# EAGLE design CanBusFinal (EAGLE 7.6.0)
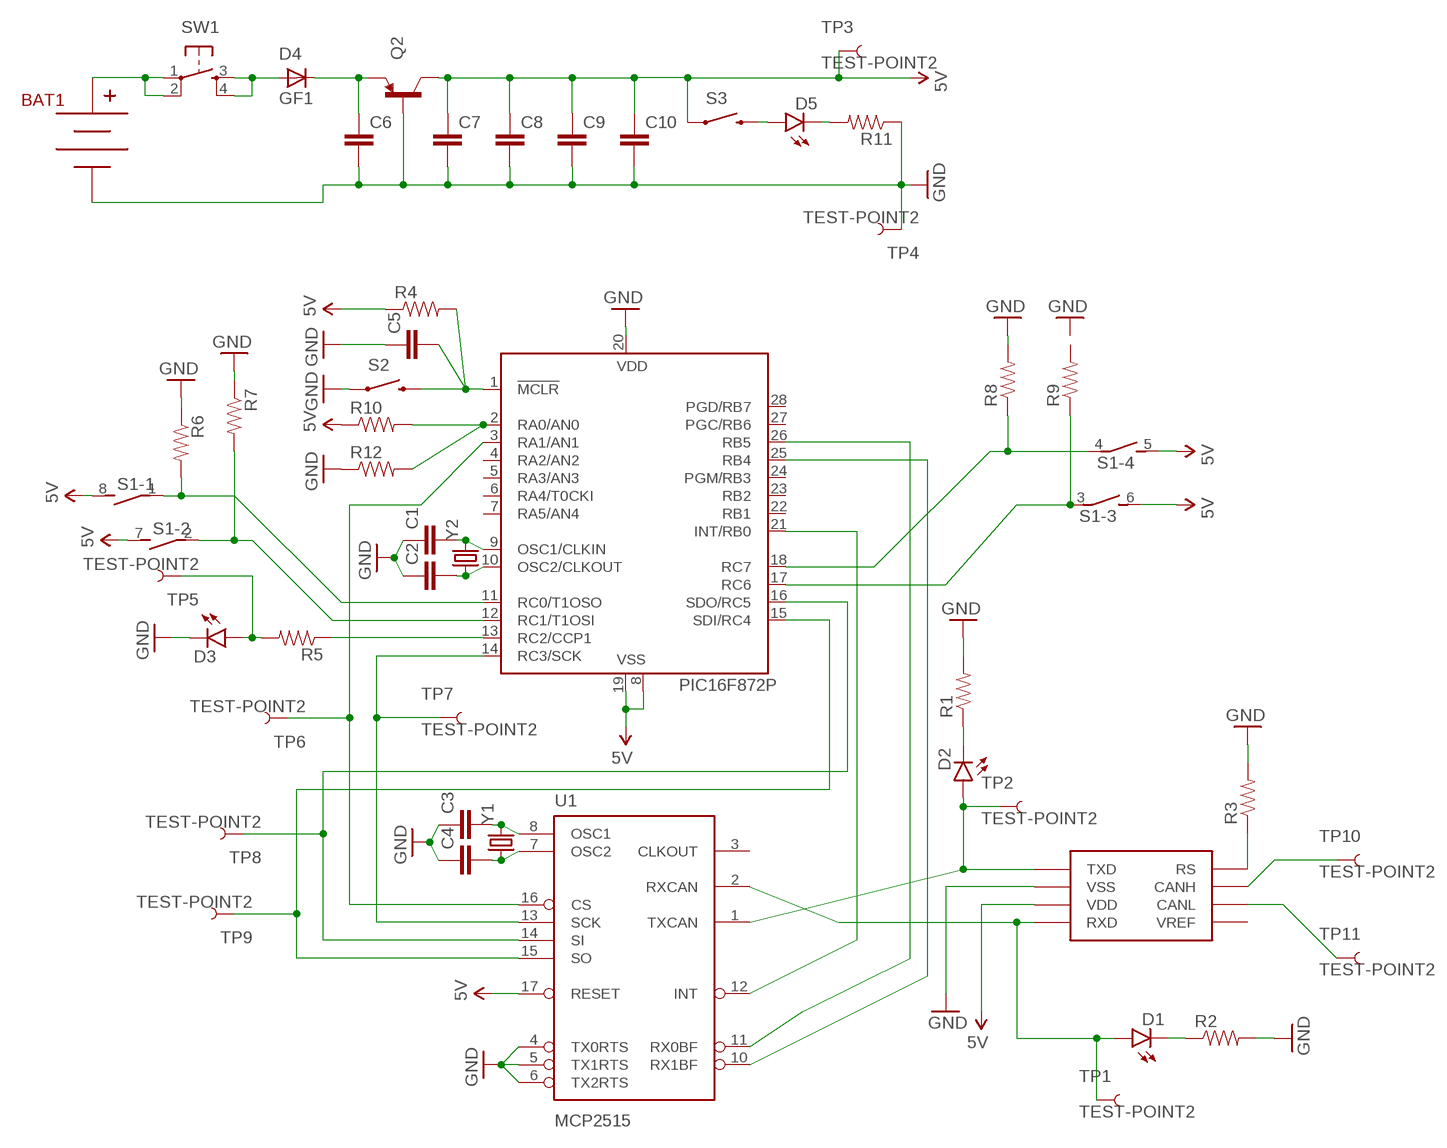
[diagram p0: schematic, sheet 1]

## Parts
BAT1  BC9VPC  [BC9VPC]
C1  CAPPTH  [CAP-PTH-SMALL]
C2  CAPPTH  [CAP-PTH-SMALL]
C3  CAPPTH  [CAP-PTH-SMALL]
C4  CAPPTH  [CAP-PTH-SMALL]
C5  CAPPTH  [CAP-PTH-SMALL]
C6  CAPPTH  [CAP-PTH-SMALL]
C7  CAPPTH  [CAP-PTH-SMALL]
C8  CAPPTH  [CAP-PTH-SMALL]
C9  CAPPTH  [CAP-PTH-SMALL]
C10  CAPPTH  [CAP-PTH-SMALL]
D1  LED5MM  [LED5MM]
D2  LED5MM  [LED5MM]
D3  LED5MM  [LED5MM]
D4  GF1  [SMA-DO214AC]
D5  LED5MM  [LED5MM]
IC1  PIC16F872P  [DIL28-3]
Q2  TRANSISTOR_PNPTO92  [TO-92]
R1  RESISTOREZ  [AXIAL-0.3EZ]
R2  RESISTOREZ  [AXIAL-0.3EZ]
R3  RESISTOREZ  [AXIAL-0.3EZ]
R4  RESISTOREZ  [AXIAL-0.3EZ]
R5  RESISTOREZ  [AXIAL-0.3EZ]
R6  RESISTOREZ  [AXIAL-0.3EZ]
R7  RESISTOREZ  [AXIAL-0.3EZ]
R8  RESISTOREZ  [AXIAL-0.3EZ]
R9  RESISTOREZ  [AXIAL-0.3EZ]
R10  RESISTOREZ  [AXIAL-0.3EZ]
R11  RESISTOREZ  [AXIAL-0.3EZ]
R12  RESISTORAXIAL-0.3  [AXIAL-0.3]
S1  DIP04S  [DIP04S]
S2  SWITCH-MOMENTARY-2PTH  [TACTILE-PTH]
S3  SWITCH-MOMENTARY-2PTH  [TACTILE-PTH]
SW1  SWITCH_SPST_4_PINSQUARE  [TACTILE-SWITCH-SMD]
TP1  TEST-POINT2  [PAD.02X.02]
TP2  TEST-POINT2  [PAD.02X.02]
TP3  TEST-POINT2  [PAD.02X.02]
TP4  TEST-POINT2  [PAD.02X.02]
TP5  TEST-POINT2  [PAD.02X.02]
TP6  TEST-POINT2  [PAD.02X.02]
TP7  TEST-POINT2  [PAD.02X.02]
TP8  TEST-POINT2  [PAD.02X.02]
TP9  TEST-POINT2  [PAD.02X.02]
TP10  TEST-POINT2  [PAD.02X.02]
TP11  TEST-POINT2  [PAD.02X.02]
U1  MCP2515  MCP2510P  [DIL18]
U$1  MCP2551  [MCP2551]
Y1  CRYSTALHC49UV  [HC49U-V]
Y2  CRYSTALHC49UV  [HC49U-V]

## Nets
5V: C7.1 C8.1 C9.1 C10.1 IC1.8(VSS) IC1.19(VSS) Q2.3(C) R4.P$1 R10.P$1 S1.5 S1.6 S1.7 S1.8 S3.1 TP3.P$1 U1.17(RESET) U$1.VDD
GND: BAT1.V- C1.1 C2.1 C3.1 C4.1 C5.1 C6.2 C7.2 C8.2 C9.2 C10.2 D3.K(C) IC1.20(VDD) Q2.2(B) R1.P$2 R2.P$2 R3.P$2 R6.P$1 R7.P$1 R8.P$2 R11.P$1 R12.P$1 S2.1 TP4.P$1 U1.4(TX0RTS) U1.5(TX1RTS) U1.6(TX2RTS) U$1.VSS
N$1: D1.A TP1.P$1 U1.2(RXCAN) U$1.RXD
N$2: D2.A TP2.P$1 U1.1(TXCAN) U$1.TXD
N$3: D2.K(C) R1.P$1
N$4: D1.K(C) R2.P$1
N$5: IC1.21(INT/RB0) U1.12(INT)
N$6: IC1.26(RB5) U1.11(RX0BF)
N$7: IC1.25(RB4) U1.10(RX1BF)
N$8: IC1.11(RC0/T1OSO) R6.P$2 S1.1
N$9: R3.P$1 U$1.RS
N$10: IC1.2(RA0/AN0) R10.P$2 R12.P$2
N$11: C3.2 U1.8(OSC1) Y1.2
N$12: C4.2 U1.7(OSC2) Y1.1
N$13: C1.2 IC1.9(OSC1/CLKIN) Y2.2
N$14: C2.2 IC1.10(OSC2/CLKOUT) Y2.1
N$15: IC1.14(RC3/SCK) TP7.P$1 U1.13(SCK)
N$16: IC1.16(SDO/RC5) TP8.P$1 U1.14(SI)
N$17: IC1.15(SDI/RC4) TP9.P$1 U1.15(SO)
N$18: IC1.3(RA1/AN1) TP6.P$1 U1.16(CS)
N$19: C5.2 IC1.1(!MCLR!) R4.P$2 S2.3
N$20: IC1.13(RC2/CCP1) R5.P$1
N$21: D3.A R5.P$2 TP5.P$1
N$23: IC1.12(RC1/T1OSI) R7.P$2 S1.2
N$24: IC1.17(RC6) R9.P$1 S1.3
N$25: IC1.18(RC7) R8.P$1 S1.4
N$26: D4.A SW1.3 SW1.4
N$27: C6.1 D4.K(C) Q2.1(E)
N$28: D5.K(C) R11.P$2
N$29: BAT1.V+ SW1.1 SW1.2
N$30: D5.A S3.3
N$31: TP11.P$1 U$1.CANL
N$32: TP10.P$1 U$1.CANH
Unconnected: IC1.4(RA2/AN2) IC1.5(RA3/AN3) IC1.6(RA4/T0CKI) IC1.7(RA5/AN4) IC1.22(RB1) IC1.23(RB2) IC1.24(PGM/RB3) IC1.27(PGC/RB6) IC1.28(PGD/RB7) R9.P$2 U1.3(CLKOUT) U$1.VREF

## Power pins joined to a net without a drawn wire
VDD: U1.18(VDD)
VSS: U1.9(VSS)

## Library data of the parts
BAT1 = SparkFun-Connectors:BC9VPC: 9V board-mount battery cradle; PROD_ID: BATT-10855
C1-C10 = SparkFun-Passives:CAP: Capacitor Standard 0603 ceramic capacitor, and 0.1" leaded capacitor.
D1-D3 D5 = SparkFun-LED:LED: LEDs Standard schematic elements and footprints for 5mm, 3mm, 1206, and 0603 sized LEDs. 5mm - Spark Fun Electronics SKU : COM-00529 (and others)
D4 = diode:GF1: DIODE
IC1 = microchip:PIC16*872: MICROCONTROLLER flash type; MF: MICROCHIP; MPN: PIC16F872-I/SP; OC_FARNELL: 9761012; OC_NEWARK: 12C1945
Q2 = SparkFun-DiscreteSemi:TRANSISTOR_PNP: Generic PNP BJT Double check pinouts against datasheets- not all devices are the same! MMBT3906 - 40V 200mA SOT-23 (TRANS-08052) MMBT4403 - 40V 600mA SOT-23 (TRANS-09245)
R1-R11 = SparkFun-Passives:RESISTOR: Resistor Basic schematic elements and footprints for 0603, 1206, and PTH resistors.
R12 = SparkFun-Resistors:RESISTOR: Resistor Basic schematic elements and footprints for 0603, 1206, and PTH resistors.
S1 = switch-dil:DIP04S: DIL/CODE SWITCH; OC_FARNELL: unknown; OC_NEWARK: unknown
S2 S3 = SparkFun-Electromechanical:SWITCH-MOMENTARY-2: Various NO switches- pushbuttons, reed, etc; PROD_ID: SWCH-08441
SW1 = SparkFun-Electromechanical:SWITCH_SPST_4_PIN; PROD_ID: SWCH-08247
TP1-TP11 = SparkFun-Passives:TEST-POINT: Bare copper test points for troubleshooting or ICT
U1 = SparkFun-DigitalIC:MCP2510: CAN controller with SPI interface to any MCU. Original design by Microchip.
U$1 = mylibrary:MCP2551
Y1 Y2 = SparkFun-FreqCtrl:CRYSTAL: Various standard crystals. Proven footprints.

## Board
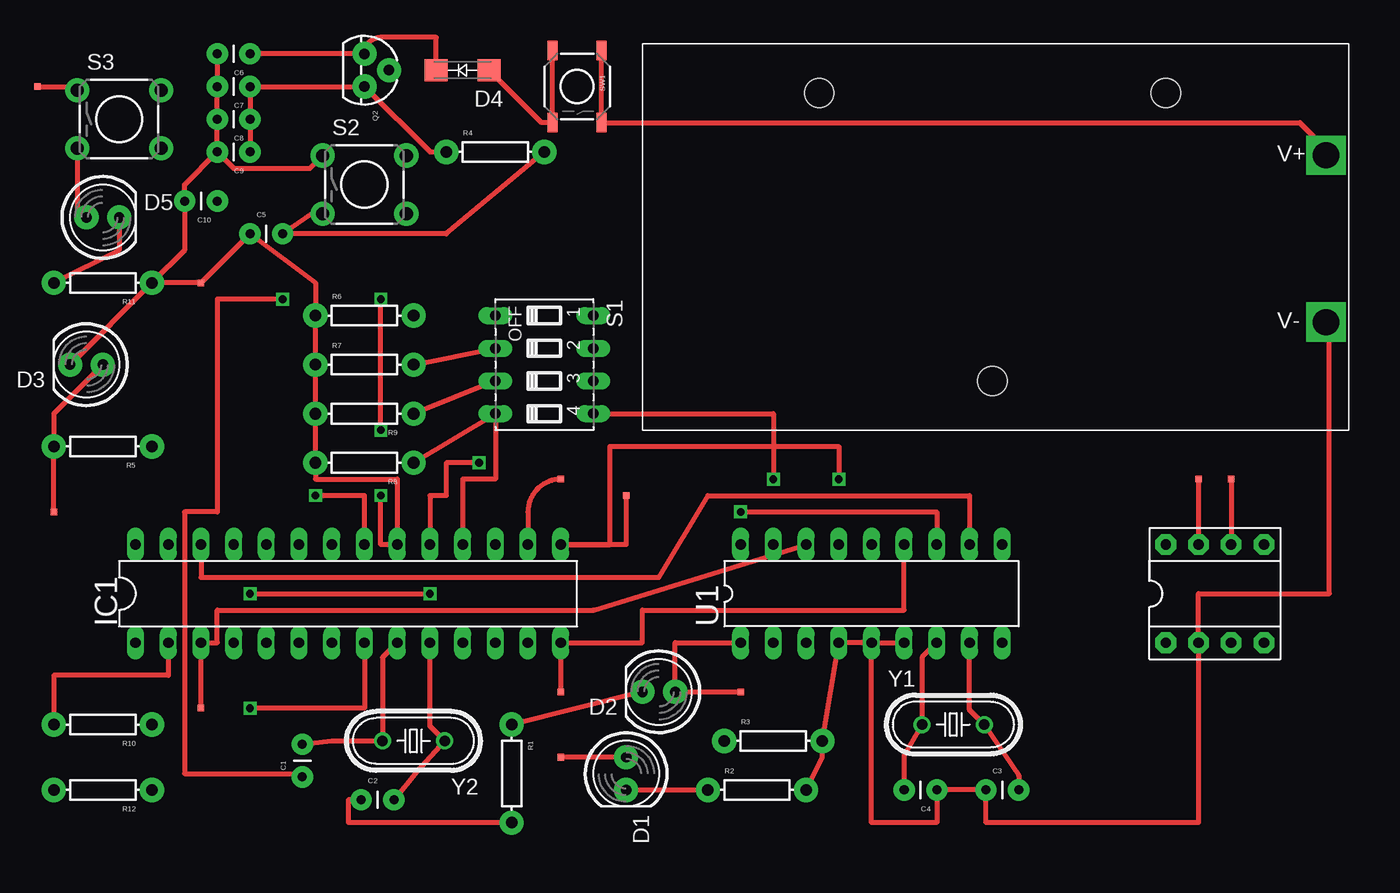
[diagram p1: board, top side]
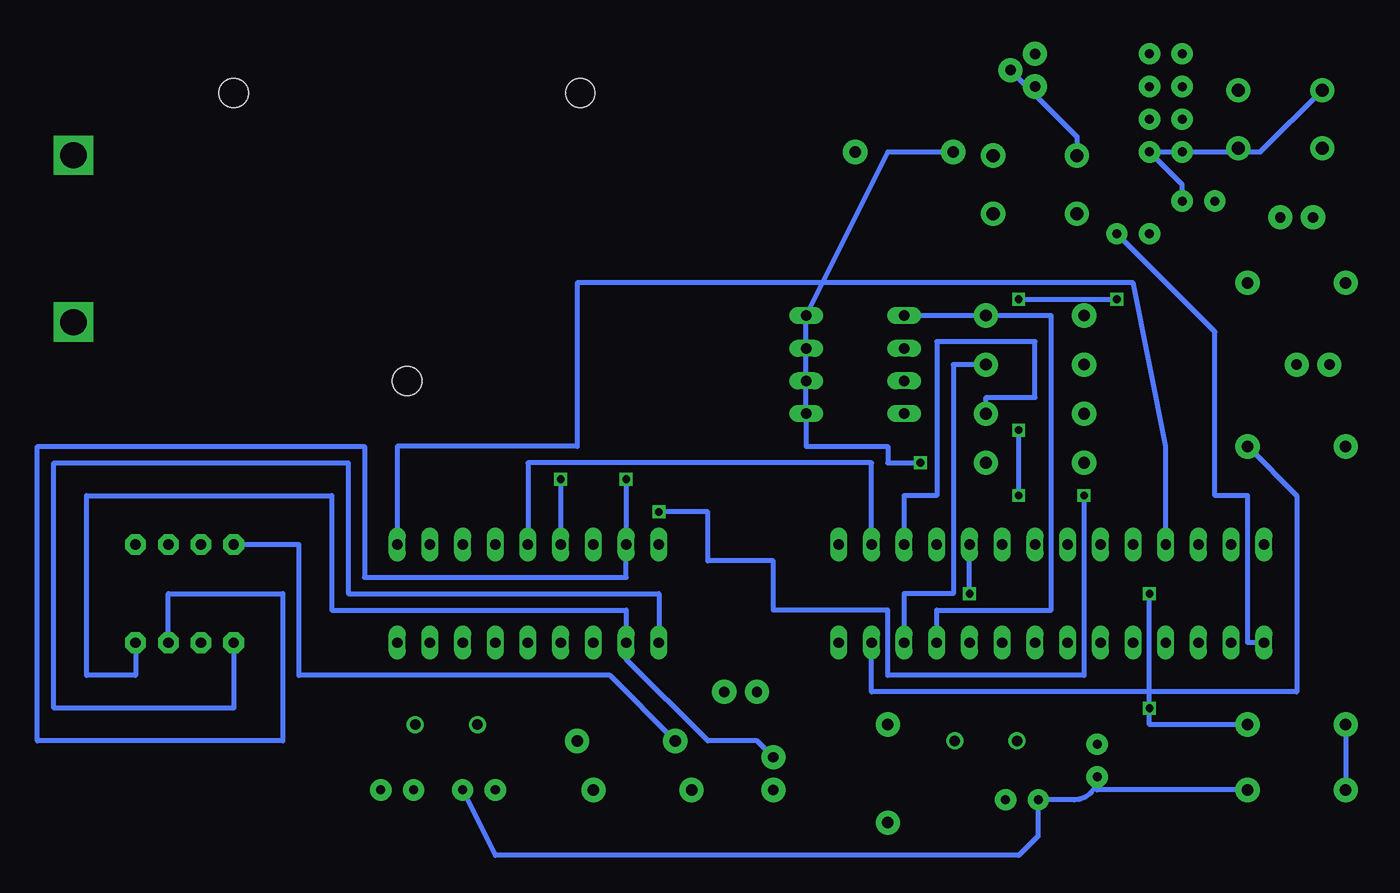
[diagram p2: board, bottom side, seen from below]

No outline drawn. Coordinates in mm, seen from the top.
Copper layers (1*16): Top 0.035mm / dielectric 1.5mm / Bottom 0.035mm
Design rules "default": minimum track width 10mil, minimum drill 24mil, track to track 8mil, track to pad 8mil, pad to pad 8mil, via to via 8mil, smd to smd 8mil, copper to edge 40mil, drill to drill 8mil, minimum pad ring 10mil, minimum via ring 8mil, stop-mask expansion 4mil, vias tented up to drill 0mil, thermal gap 10mil

### Footprints (pad centres in the part's own frame; a part is rotated, then mirrored left to right if it is on the bottom)
BC9VPC = drill 2.032 square: V+ 53.086,21.336; V- 53.086,8.382 | hole 2.286: 27.178,3.81; 13.716,26.162; 40.64,26.162
CAP-PTH-SMALL = drill 0.7 pad 1.651: 1 0,0; 2 2.54,0
LED5MM = drill 0.813 pad 1.88: A -1.27,0; K 1.27,0
SMA-DO214AC = smd 1.8 x 1.7: A -2.05,0; K 2.05,0
DIL28-3 = drill 0.813 long: 1 -16.51,-3.81; 2 -13.97,-3.81; 3 -11.43,-3.81; 4 -8.89,-3.81; 5 -6.35,-3.81; 6 -3.81,-3.81; 7 -1.27,-3.81; 8 1.27,-3.81; 9 3.81,-3.81; 10 6.35,-3.81; 11 8.89,-3.81; 12 11.43,-3.81; 13 13.97,-3.81; 14 16.51,-3.81; 15 16.51,3.81; 16 13.97,3.81; 17 11.43,3.81; 18 8.89,3.81; 19 6.35,3.81; 20 3.81,3.81; 21 1.27,3.81; 22 -1.27,3.81; 23 -3.81,3.81; 24 -6.35,3.81; 25 -8.89,3.81; 26 -11.43,3.81; 27 -13.97,3.81; 28 -16.51,3.81
TO-92 = drill 0.813 pad 1.88: 1 -1.27,0; 2 0,1.905; 3 1.27,0
AXIAL-0.3EZ = drill 0.9 pad 1.88: P$1 -3.81,0; P$2 3.81,0
AXIAL-0.3 = drill 0.9 pad 1.88: P$1 -3.81,0; P$2 3.81,0
DIP04S = drill 0.813 long: 1 -3.81,-3.81; 2 -1.27,-3.81; 3 1.27,-3.81; 4 3.81,-3.81; 5 3.81,3.81; 6 1.27,3.81; 7 -1.27,3.81; 8 -3.81,3.81
TACTILE-PTH = drill 1.016 pad 1.88: 1 -3.251,2.261; 2 3.251,2.261; 3 -3.251,-2.261; 4 3.251,-2.261
TACTILE-SWITCH-SMD = smd 1.524 x 0.762: 1 -2.794,1.905; 2 2.794,1.905; 3 -2.794,-1.905; 4 2.794,-1.905
PAD.02X.02 = smd 0.508 x 0.508: P$1 0,0
DIL18 = drill 0.813 long: 1 -10.16,-3.81; 2 -7.62,-3.81; 3 -5.08,-3.81; 4 -2.54,-3.81; 5 0,-3.81; 6 2.54,-3.81; 7 5.08,-3.81; 8 7.62,-3.81; 9 10.16,-3.81; 10 10.16,3.81; 11 7.62,3.81; 12 5.08,3.81; 13 2.54,3.81; 14 0,3.81; 15 -2.54,3.81; 16 -5.08,3.81; 17 -7.62,3.81; 18 -10.16,3.81
MCP2551 = drill 0.813 pad 1.6 octagon: CANH -1.27,3.81; CANL 1.27,3.81; RS -3.81,3.81; RXD 3.81,-3.81; TXD -3.81,-3.81; VDD 1.27,-3.81; VREF 3.81,3.81; VSS -1.27,-3.81
HC49U-V = drill 0.813: 1 -2.413,0; 2 2.413,0

### Placement (x,y rotation side)
BAT1  46.99,33.02 0 top
C1  20.57,6.1 90 top
C2  25.15,4.32 0 top
C3  73.66,5.08 0 top
C4  69.85,5.08 180 top
C5  16.51,48.26 0 top
C6  16.51,62.23 180 top
C7  16.51,59.69 180 top
C8  16.51,57.15 180 top
C9  16.51,54.61 180 top
C10  13.97,50.8 180 top
D1  45.72,6.35 270 top
D2  48.26,12.7 180 top
D3  3.81,38.1 180 top
D4  33.02,60.96 180 top
D5  5.08,49.53 0 top
IC1  24.13,20.32 0 top
Q2  25.4,60.96 270 top
R1  36.83,6.35 270 top
R2  55.88,5.08 0 top
R3  57.15,8.89 0 top
R4  35.56,54.61 0 top
R5  5.08,31.75 180 top
R6  25.4,41.91 0 top
R7  25.4,38.1 0 top
R8  25.4,30.48 180 top
R9  25.4,34.29 180 top
R10  5.08,10.16 180 top
R11  5.08,44.45 180 top
R12  5.08,5.08 180 top
S1  39.37,38.1 270 top
S2  25.4,52.07 0 top
S3  6.35,57.15 0 top
SW1  41.91,59.69 270 top
TP1  40.64,7.62 90 top
TP2  54.61,12.7 0 top
TP3  0,59.69 0 top
TP4  12.7,44.45 0 top
TP5  1.27,26.67 0 top
TP6  12.7,11.43 0 top
TP7  40.64,12.7 0 top
TP8  40.64,29.21 0 top
TP9  45.72,27.94 0 top
TP10  90.17,29.21 0 top
TP11  92.71,29.21 0 top
U1  64.77,20.32 0 top
U$1  91.44,20.32 0 top
Y1  71.12,10.16 0 top
Y2  29.21,8.89 180 top

### Tracks (layer width: path | path; a pad name or v marks a point on that pad's centre or on a via)
5V  (via drill 0.6)
  Top 0.406: C9.1 C8.1 C7.1 Q2.3 30.48,54.61 R4.P$1 | TP3.P$1 2.82,59.69 S3.1 | S1.5 57.15,34.29 v57.15,29.21 | v34.29,30.48 31.75,30.48 31.75,27.94 30.48,27.94 IC1.19 | IC1.8 25.4,11.43 v16.51,11.43 | v16.51,20.32 v30.48,20.32
  Bottom 0.406: S3.1 7.9,54.61 C9.1 13.97,52.07 C10.1 | R4.P$1 36.83,54.61 S1.8 S1.7 S1.6 S1.5 43.18,31.75 36.83,31.75 36.83,30.48 v34.29,30.48 | U$1.VDD 92.71,20.32 83.82,20.32 83.82,8.89 102.87,8.89 102.87,31.75 77.47,31.75 77.47,21.59 57.15,21.59 U1.17 v57.15,29.21 | v16.51,20.32 v16.51,11.43 16.51,10.16 R10.P$1 | v30.48,20.32 IC1.19
GND  (via drill 0.6)
  Top 0.406: C6.2 C7.2 C8.2 C9.2 | C9.2 11.43,52.07 C10.2 11.43,46.99 R11.P$1 | C9.2 15.24,53.34 21.16,53.34 S2.1 | R11.P$1 TP4.P$1 C5.1 21.59,44.45 R6.P$1 R7.P$1 R8.P$2 21.59,29.21 27.94,29.21 IC1.20 26.67,24.13 v26.67,27.94 | R11.P$1 D3.K | BAT1.V- 100.33,41.4 100.33,20.32 90.17,20.32 U$1.VSS 90.17,2.54 73.66,2.54 C3.1 C4.1 69.85,2.54 64.77,2.54 U1.5 | U1.5 U1.4 R3.P$2 60.96,7.62 R2.P$2 | U1.5 U1.6 | R1.P$2 24.13,2.54 24.13,4.32 C2.1 | v26.67,33.02 v26.67,43.18 | v19.05,43.18 13.97,43.18 13.97,26.67 11.43,26.67 11.43,6.35 20.57,6.35 C1.1
  Bottom 0.406: Q2.2 22.15,55.8 S2.1 | C4.1 67.31,0 26.67,0 25.15,1.52 C2.1 22.35,4.32 arc-90 C1.1 | v26.67,27.94 v26.67,33.02 | v26.67,43.18 v19.05,43.18 | 20.57,6.35 C1.1 | R12.P$1 20.57,5.08 C1.1
N$1
  Top 0.406: D1.A TP1.P$1
  Bottom 0.406: D1.A 46.99,8.89 50.8,8.89 57.15,15.24 U1.2 57.15,19.05 80.01,19.05 80.01,27.94 99.06,27.94 99.06,13.97 95.25,13.97 U$1.RXD
N$2
  Top 0.406: U1.1 49.53,16.51 D2.A TP2.P$1
  Bottom 0.406: U$1.TXD 87.63,11.43 101.6,11.43 101.6,30.48 78.74,30.48 78.74,20.32 54.61,20.32 U1.1
N$3
  Top 0.406: D2.K R1.P$1
N$4
  Top 0.406: D1.K R2.P$1
N$5  (via drill 0.6)
  Top 0.406: IC1.21 25.4,27.94 v21.59,27.94 | v54.61,26.67 69.85,26.67 U1.12
  Bottom 0.406: v21.59,27.94 21.59,13.97 36.83,13.97 36.83,19.05 45.72,19.05 45.72,22.86 50.8,22.86 50.8,26.67 v54.61,26.67
N$6
  Top 0.406: IC1.26 12.7,21.59 48.26,21.59 52.07,27.94 72.39,27.94 U1.11
N$7
  Bottom 0.406: IC1.25 15.24,31.75 17.78,44.45 60.96,44.45 60.96,31.75 74.93,31.75 U1.10
N$8
  Bottom 0.406: S1.1 R6.P$2 24.13,41.91 24.13,19.05 33.02,19.05 IC1.11
N$9
  Bottom 0.406: R3.P$1 58.42,13.97 82.55,13.97 82.55,24.13 U$1.RS
N$10
  Top 0.406: IC1.2 10.16,13.97 1.27,13.97 R10.P$2
  Bottom 0.406: R10.P$2 R12.P$2
N$11
  Top 0.406: U1.8 72.39,11.3 Y1.2 76.2,6.22 C3.2
N$12
  Top 0.406: U1.7 68.71,15.37 Y1.1 67.31,7.75 C4.2
N$13
  Top 0.406: C1.2 22.86,8.89 Y2.2 26.8,15.37 IC1.9
N$14
  Top 0.406: IC1.10 30.48,10.03 Y2.1 29.46,6.48 C2.2
N$15
  Top 0.406: TP7.P$1 IC1.14 46.99,16.51 46.99,19.05 67.31,19.05 U1.13
N$16
  Top 0.406: TP8.P$1 arc90 38.1,26.67 IC1.16
  Bottom 0.406: IC1.16 38.1,30.48 64.77,30.48 U1.14
N$17  (via drill 0.6)
  Top 0.406: TP9.P$1 45.72,24.13 IC1.15 44.45,24.13 44.45,31.75 62.23,31.75 v62.23,29.21
  Bottom 0.406: v62.23,29.21 U1.15
N$18
  Top 0.406: TP6.P$1 IC1.3 13.97,16.51 13.97,19.05 43.18,19.05 U1.16
N$19
  Top 0.406: S2.3 21.31,49.81 C5.2 31.75,48.26 R4.P$2
  Bottom 0.406: IC1.1 8.89,16.51 8.89,27.94 11.43,27.94 11.43,40.64 C5.2
N$20
  Bottom 0.406: R5.P$1 5.08,27.94 5.08,12.7 38.1,12.7 IC1.13
N$21
  Top 0.406: D3.A 1.27,34.29 R5.P$2 TP5.P$1
N$23
  Top 0.406: R7.P$2 S1.2
  Bottom 0.406: R7.P$2 31.75,38.1 31.75,20.32 35.56,20.32 IC1.12
N$24
  Top 0.406: S1.3 R9.P$1
  Bottom 0.406: R9.P$1 29.21,35.56 25.4,35.56 25.4,39.88 33.02,39.88 33.02,27.94 35.56,27.94 IC1.17
N$25
  Top 0.406: R8.P$1 S1.4 35.56,29.21 33.02,29.21 IC1.18
N$26
  Top 0.406: D4.A 39.13,56.9 SW1.4 SW1.3
N$27
  Top 0.406: D4.K 30.97,63.5 26.67,63.5 arc90 Q2.1 C6.1
N$28
  Top 0.406: D5.K 6.35,46.99 R11.P$2
N$29
  Top 0.406: BAT1.V+ 99.06,55.37 99.06,55.88 98.04,56.9 SW1.2 SW1.1
N$30
  Top 0.406: S3.3 3.1,50.24 D5.A
N$31
  Top 0.406: TP11.P$1 U$1.CANL
N$32
  Top 0.406: TP10.P$1 U$1.CANH